# EAGLE schematic Educ-8 (EAGLE 6.6.0)

## Sheet 1 of 3
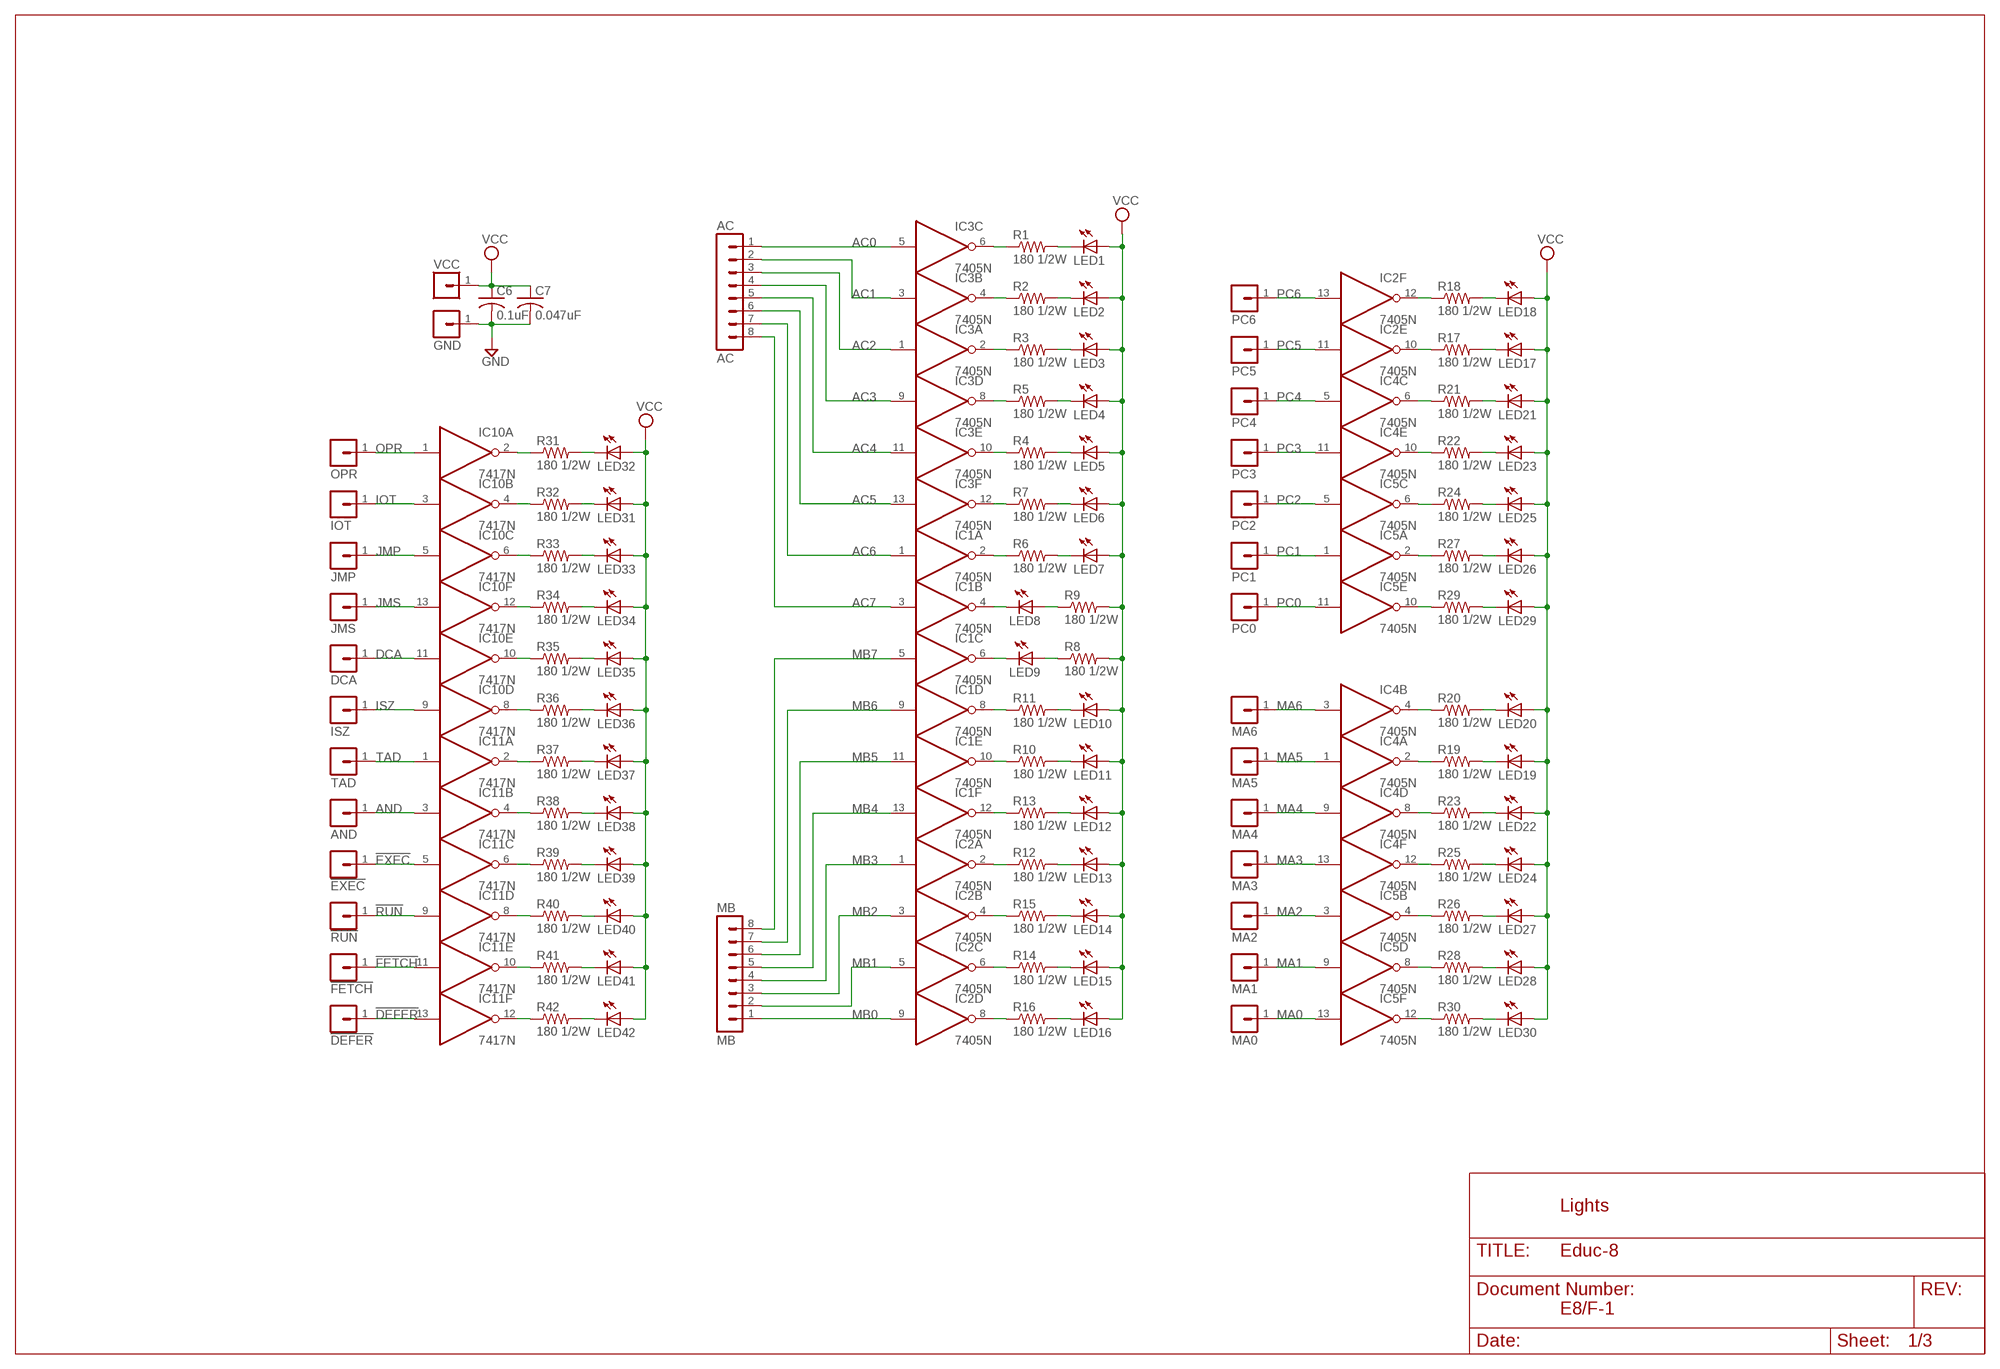
[diagram p0: schematic, sheet 1]

### Parts
!DEFER  MA01-1  [MA01-1]
!EXEC  MA01-1  [MA01-1]
!FETCH  MA01-1  [MA01-1]
!RUN  MA01-1  [MA01-1]
AC  AC  MA08-1  [MA08-1]
AND  MA01-1  [MA01-1]
C6  0.1uF  C-US075-032X103  [C075-032X103]
C7  0.047uF  C-US075-032X103  [C075-032X103]
DCA  MA01-1  [MA01-1]
GND  MA01-1  [MA01-1]
IC1  7405N  [DIL14]
IC2  7405N  [DIL14]
IC3  7405N  [DIL14]
IC4  7405N  [DIL14]
IC5  7405N  [DIL14]
IC10  7417N  [DIL14]
IC11  7417N  [DIL14]
IOT  MA01-1  [MA01-1]
ISZ  MA01-1  [MA01-1]
JMP  MA01-1  [MA01-1]
JMS  MA01-1  [MA01-1]
LED1  LED5MM  [LED5MM]
LED2  LED5MM  [LED5MM]
LED3  LED5MM  [LED5MM]
LED4  LED5MM  [LED5MM]
LED5  LED5MM  [LED5MM]
LED6  LED5MM  [LED5MM]
LED7  LED5MM  [LED5MM]
LED8  LED5MM  [LED5MM]
LED9  LED5MM  [LED5MM]
LED10  LED5MM  [LED5MM]
LED11  LED5MM  [LED5MM]
LED12  LED5MM  [LED5MM]
LED13  LED5MM  [LED5MM]
LED14  LED5MM  [LED5MM]
LED15  LED5MM  [LED5MM]
LED16  LED5MM  [LED5MM]
LED17  LED5MM  [LED5MM]
LED18  LED5MM  [LED5MM]
LED19  LED5MM  [LED5MM]
LED20  LED5MM  [LED5MM]
LED21  LED5MM  [LED5MM]
LED22  LED5MM  [LED5MM]
LED23  LED5MM  [LED5MM]
LED24  LED5MM  [LED5MM]
LED25  LED5MM  [LED5MM]
LED26  LED5MM  [LED5MM]
LED27  LED5MM  [LED5MM]
LED28  LED5MM  [LED5MM]
LED29  LED5MM  [LED5MM]
LED30  LED5MM  [LED5MM]
LED31  LED5MM  [LED5MM]
LED32  LED5MM  [LED5MM]
LED33  LED5MM  [LED5MM]
LED34  LED5MM  [LED5MM]
LED35  LED5MM  [LED5MM]
LED36  LED5MM  [LED5MM]
LED37  LED5MM  [LED5MM]
LED38  LED5MM  [LED5MM]
LED39  LED5MM  [LED5MM]
LED40  LED5MM  [LED5MM]
LED41  LED5MM  [LED5MM]
LED42  LED5MM  [LED5MM]
MA0  MA01-1  [MA01-1]
MA1  MA01-1  [MA01-1]
MA2  MA01-1  [MA01-1]
MA3  MA01-1  [MA01-1]
MA4  MA01-1  [MA01-1]
MA5  MA01-1  [MA01-1]
MA6  MA01-1  [MA01-1]
MB  MB  MA08-1  [MA08-1]
OPR  MA01-1  [MA01-1]
PC0  MA01-1  [MA01-1]
PC1  MA01-1  [MA01-1]
PC2  MA01-1  [MA01-1]
PC3  MA01-1  [MA01-1]
PC4  MA01-1  [MA01-1]
PC5  MA01-1  [MA01-1]
PC6  MA01-1  [MA01-1]
R1  180 1/2W  R-US_0309/.45  [0309/.45]
R2  180 1/2W  R-US_0309/.45  [0309/.45]
R3  180 1/2W  R-US_0309/.45  [0309/.45]
R4  180 1/2W  R-US_0309/12  [0309/12]
R5  180 1/2W  R-US_0309/.45  [0309/.45]
R6  180 1/2W  R-US_0309/12  [0309/12]
R7  180 1/2W  R-US_0309/.45  [0309/.45]
R8  180 1/2W  R-US_0309/12  [0309/12]
R9  180 1/2W  R-US_0309/12  [0309/12]
R10  180 1/2W  R-US_0309/.45  [0309/.45]
R11  180 1/2W  R-US_0309/11  [0309/11]
R12  180 1/2W  R-US_0309/12  [0309/12]
R13  180 1/2W  R-US_0309/.45  [0309/.45]
R14  180 1/2W  R-US_0309/.45  [0309/.45]
R15  180 1/2W  R-US_0309/12  [0309/12]
R16  180 1/2W  R-US_0309/12  [0309/12]
R17  180 1/2W  R-US_0309/12  [0309/12]
R18  180 1/2W  R-US_0309/12  [0309/12]
R19  180 1/2W  R-US_0309/12  [0309/12]
R20  180 1/2W  R-US_0309/15  [0309/15]
R21  180 1/2W  R-US_0309/.45  [0309/.45]
R22  180 1/2W  R-US_0309/10  [0309/10]
R23  180 1/2W  R-US_0309/10  [0309/10]
R24  180 1/2W  R-US_0309/12  [0309/12]
R25  180 1/2W  R-US_0309/10  [0309/10]
R26  180 1/2W  R-US_0309/10  [0309/10]
R27  180 1/2W  R-US_0309/15  [0309/15]
R28  180 1/2W  R-US_0309/.45  [0309/.45]
R29  180 1/2W  R-US_0309/.45  [0309/.45]
R30  180 1/2W  R-US_0309/.45  [0309/.45]
R31  180 1/2W  R-US_0309/8  [0309/8]
R32  180 1/2W  R-US_0309/8  [0309/8]
R33  180 1/2W  R-US_0309/8  [0309/8]
R34  180 1/2W  R-US_0309/8  [0309/8]
R35  180 1/2W  R-US_0309/8  [0309/8]
R36  180 1/2W  R-US_0309/8  [0309/8]
R37  180 1/2W  R-US_0309/8  [0309/8]
R38  180 1/2W  R-US_0309/8  [0309/8]
R39  180 1/2W  R-US_0309/10  [0309/10]
R40  180 1/2W  R-US_0309/10  [0309/10]
R41  180 1/2W  R-US_0309/10  [0309/10]
R42  180 1/2W  R-US_0309/10  [0309/10]
TAD  MA01-1  [MA01-1]
VCC  MA01-1  [MA01-1]

### Nets
!DEFER: !DEFER.1 IC11.13(F:I)
!EXEC: !EXEC.1 IC11.5(C:I)
!FETCH: !FETCH.1 IC11.11(E:I)
!RUN: !RUN.1 IC11.9(D:I)
AC0: AC.1 IC3.5(C:I)
AC1: AC.2 IC3.3(B:I)
AC2: AC.3 IC3.1(A:I)
AC3: AC.4 IC3.9(D:I)
AC4: AC.5 IC3.11(E:I)
AC5: AC.6 IC3.13(F:I)
AC6: AC.7 IC1.1(A:I)
AC7: AC.8 IC1.3(B:I)
AND: AND.1 IC11.3(B:I)
DCA: DCA.1 IC10.11(E:I)
GND: C6.2 C7.2 GND.1 ; also sheet 2
IOT: IC10.3(B:I) IOT.1
ISZ: IC10.9(D:I) ISZ.1
JMP: IC10.5(C:I) JMP.1
JMS: IC10.13(F:I) JMS.1
MA0: IC5.13(F:I) MA0.1
MA1: IC5.9(D:I) MA1.1
MA2: IC5.3(B:I) MA2.1
MA3: IC4.13(F:I) MA3.1
MA4: IC4.9(D:I) MA4.1
MA5: IC4.1(A:I) MA5.1
MA6: IC4.3(B:I) MA6.1
MB0: IC2.9(D:I) MB.1
MB1: IC2.5(C:I) MB.2
MB2: IC2.3(B:I) MB.3
MB3: IC2.1(A:I) MB.4
MB4: IC1.13(F:I) MB.5
MB5: IC1.11(E:I) MB.6
MB6: IC1.9(D:I) MB.7
MB7: IC1.5(C:I) MB.8
N$1: IC2.12(F:O) R18.1
N$2: IC2.10(E:O) R17.1
N$3: IC3.6(C:O) R1.1
N$4: IC3.4(B:O) R2.1
N$5: IC3.2(A:O) R3.1
N$6: IC3.12(F:O) R7.1
N$7: LED7.K(C) R6.2
N$8: LED12.K(C) R13.2
N$9: IC1.10(E:O) R10.1
N$10: LED10.K(C) R11.2
N$11: IC1.6(C:O) LED9.K(C)
N$12: LED8.A R9.1
N$13: IC1.2(A:O) R6.1
N$14: LED9.A R8.1
N$15: IC1.4(B:O) LED8.K(C)
N$16: IC1.8(D:O) R11.1
N$17: LED11.K(C) R10.2
N$18: IC2.8(D:O) R16.1
N$19: LED13.K(C) R12.2
N$20: LED18.K(C) R18.2
N$21: LED17.K(C) R17.2
N$22: LED16.K(C) R16.2
N$23: LED15.K(C) R14.2
N$24: LED14.K(C) R15.2
N$25: IC2.6(C:O) R14.1
N$26: IC2.4(B:O) R15.1
N$27: IC2.2(A:O) R12.1
N$28: IC1.12(F:O) R13.1
N$29: IC3.10(E:O) R4.1
N$30: IC3.8(D:O) R5.1
N$31: LED1.K(C) R1.2
N$32: LED6.K(C) R7.2
N$33: LED5.K(C) R4.2
N$34: LED4.K(C) R5.2
N$35: LED3.K(C) R3.2
N$36: LED2.K(C) R2.2
N$37: LED25.K(C) R24.2
N$38: LED19.K(C) R19.2
N$39: LED24.K(C) R25.2
N$40: LED23.K(C) R22.2
N$41: LED22.K(C) R23.2
N$42: LED21.K(C) R21.2
N$43: IC5.6(C:O) R24.1
N$44: LED26.K(C) R27.2
N$45: LED27.K(C) R26.2
N$46: LED28.K(C) R28.2
N$47: LED29.K(C) R29.2
N$48: LED30.K(C) R30.2
N$49: LED31.K(C) R32.2
N$50: LED32.K(C) R31.2
N$51: LED33.K(C) R33.2
N$52: LED34.K(C) R34.2
N$53: LED35.K(C) R35.2
N$54: LED36.K(C) R36.2
N$55: IC5.2(A:O) R27.1
N$56: IC5.12(F:O) R30.1
N$57: IC5.10(E:O) R29.1
N$58: IC5.8(D:O) R28.1
N$59: LED37.K(C) R37.2
N$60: IC5.4(B:O) R26.1
N$109: LED40.K(C) R40.2
N$110: LED39.K(C) R39.2
N$111: LED38.K(C) R38.2
N$112: LED42.K(C) R42.2
N$113: LED41.K(C) R41.2
N$115: IC10.2(A:O) R31.1
N$116: IC10.8(D:O) R36.1
N$117: IC10.10(E:O) R35.1
N$118: IC10.12(F:O) R34.1
N$119: IC10.6(C:O) R33.1
N$120: IC10.4(B:O) R32.1
N$127: IC11.2(A:O) R37.1
N$128: IC11.12(F:O) R42.1
N$129: IC11.10(E:O) R41.1
N$130: IC11.8(D:O) R40.1
N$131: IC11.6(C:O) R39.1
N$132: IC11.4(B:O) R38.1
N$134: LED20.K(C) R20.2
N$135: IC4.2(A:O) R19.1
N$136: IC4.4(B:O) R20.1
N$137: IC4.6(C:O) R21.1
N$138: IC4.12(F:O) R25.1
N$140: IC4.10(E:O) R22.1
N$141: IC4.8(D:O) R23.1
OPR: IC10.1(A:I) OPR.1
PC0: IC5.11(E:I) PC0.1
PC1: IC5.1(A:I) PC1.1
PC2: IC5.5(C:I) PC2.1
PC3: IC4.11(E:I) PC3.1
PC4: IC4.5(C:I) PC4.1
PC5: IC2.11(E:I) PC5.1
PC6: IC2.13(F:I) PC6.1
TAD: IC11.1(A:I) TAD.1
VCC: C6.1 C7.1 LED1.A LED2.A LED3.A LED4.A LED5.A LED6.A LED7.A LED10.A LED11.A LED12.A LED13.A LED14.A LED15.A LED16.A LED17.A LED18.A LED19.A LED20.A LED21.A LED22.A LED23.A LED24.A LED25.A LED26.A LED27.A LED28.A LED29.A LED30.A LED31.A LED32.A LED33.A LED34.A LED35.A LED36.A LED37.A LED38.A LED39.A LED40.A LED41.A LED42.A R8.2 R9.2 VCC.1 ; also sheet 2

### Notes on the sheet
- Lights
- E8/F-1

## Sheet 2 of 3
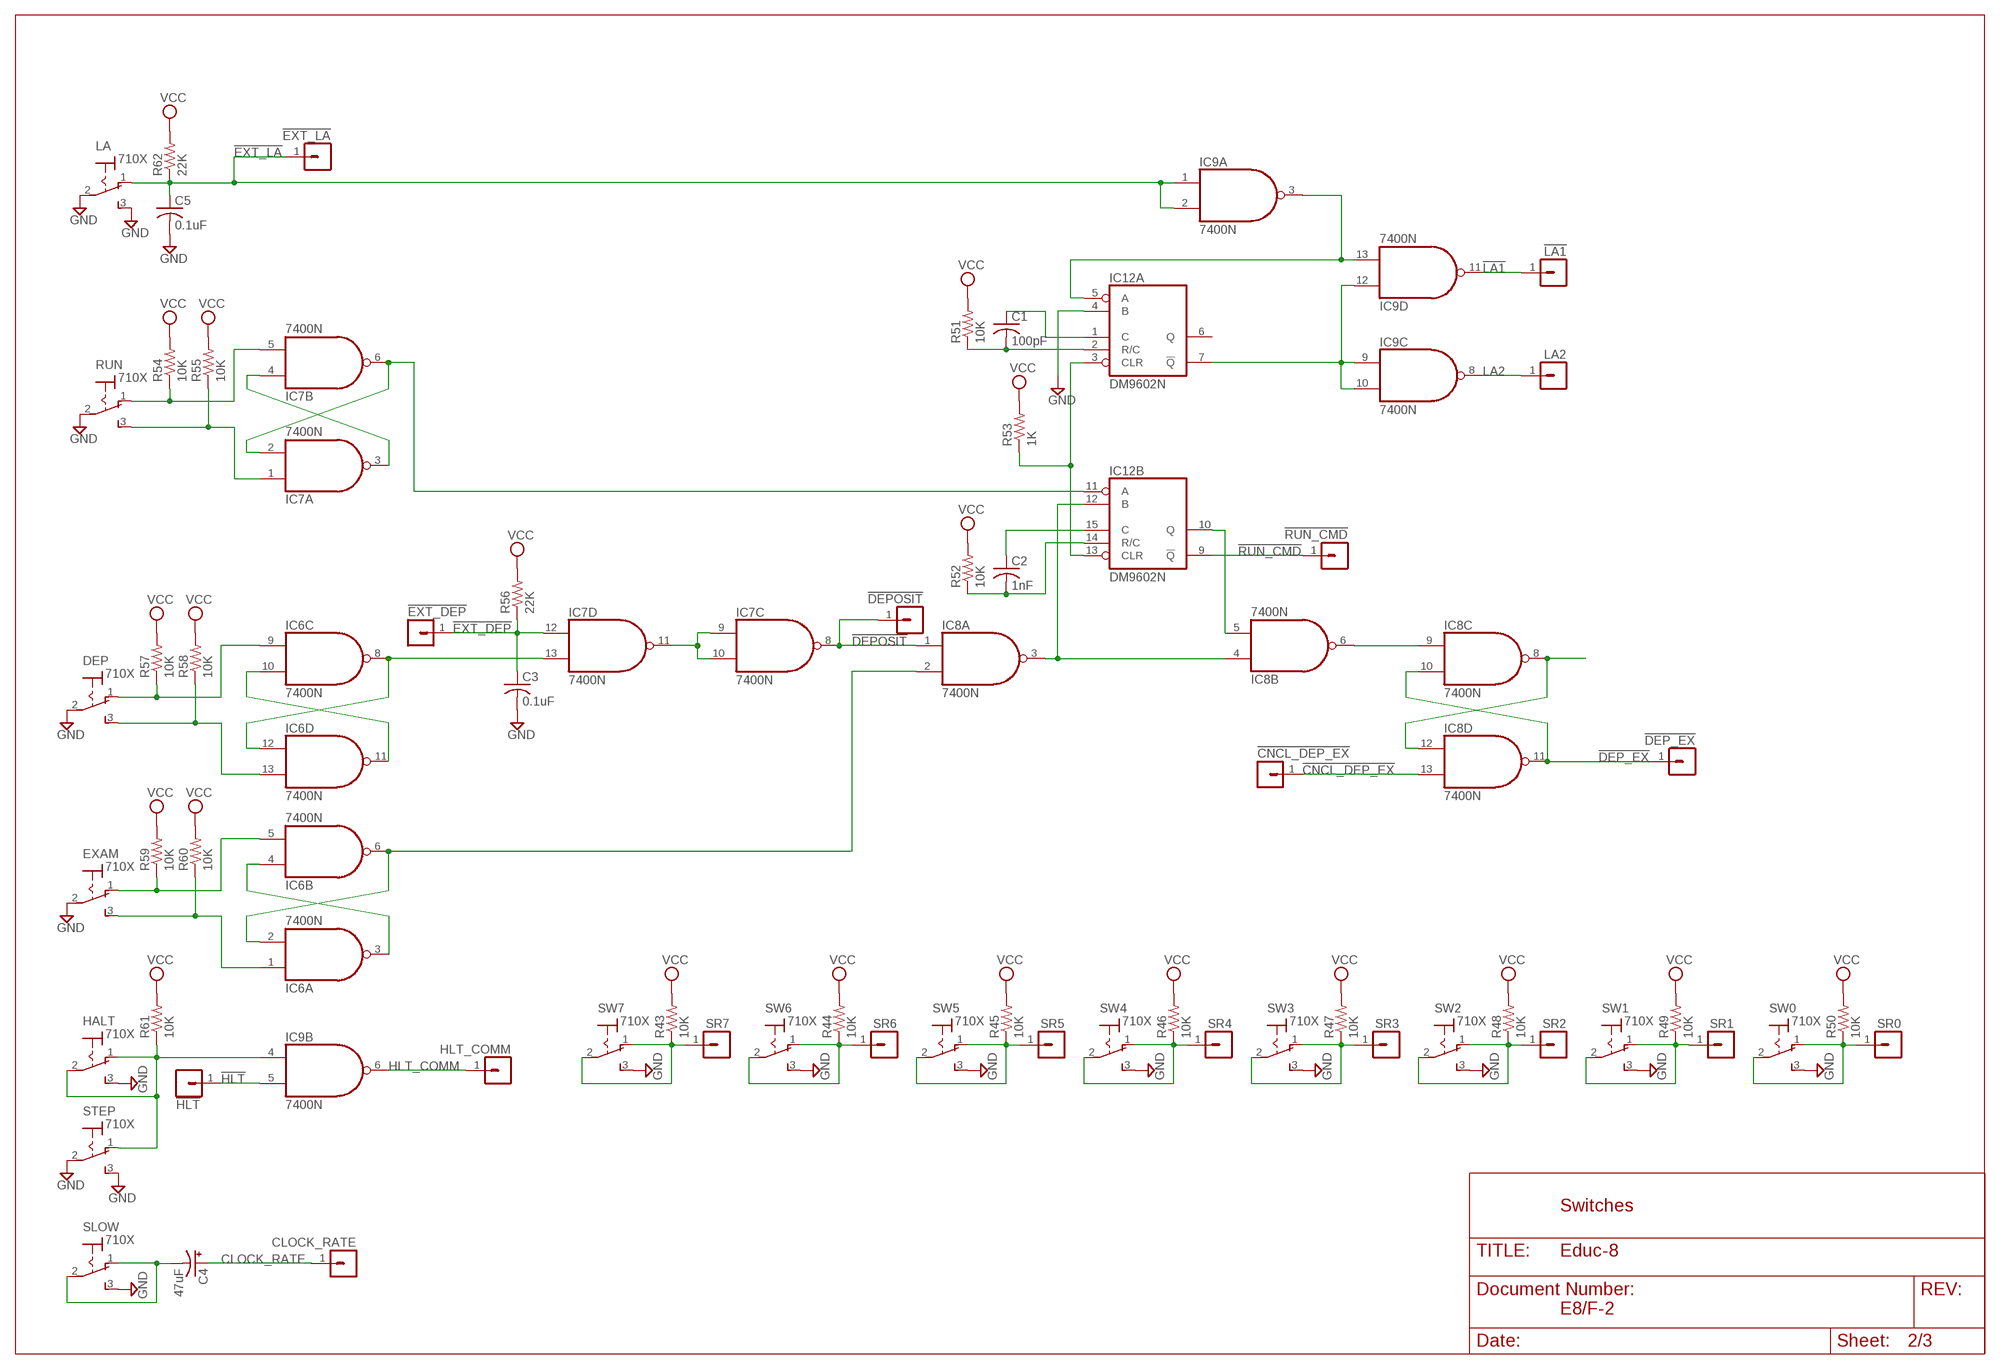
[diagram p1: schematic, sheet 2]

### Parts
!CNCL_DEP_EX  MA01-1  [MA01-1]
!DEP_EX  MA01-1  [MA01-1]
!DEPOSIT  MA01-1  [MA01-1]
!EXT_DEP  MA01-1  [MA01-1]
!EXT_LA  MA01-1  [MA01-1]
!HLT  MA01-1  [MA01-1]
!LA1  MA01-1  [MA01-1]
!RUN_CMD  MA01-1  [MA01-1]
C1  100pF  C-US075-032X103  [C075-032X103]
C2  1nF  C-US075-032X103  [C075-032X103]
C3  0.1uF  C-US  [C063-025X075]
C4  47uF  CPOL-USB45181C  [B45181C]
C5  0.1uF  C-US075-032X103  [C075-032X103]
CLOCK_RATE  MA01-1  [MA01-1]
DEP  710X  [7109]
EXAM  710X  [7109]
HALT  710X  [7109]
HLT_COMM  MA01-1  [MA01-1]
IC6  7400N  [DIL14]
IC7  7400N  [DIL14]
IC8  7400N  [DIL14]
IC9  7400N  [DIL14]
IC12  DM9602N  [DIL16]
LA  710X  [7109]
LA2  MA01-1  [MA01-1]
R43  10K  R-US_0207/12  [0207/12]
R44  10K  R-US_0207/12  [0207/12]
R45  10K  R-US_0207/12  [0207/12]
R46  10K  R-US_0207/12  [0207/12]
R47  10K  R-US_0207/12  [0207/12]
R48  10K  R-US_0207/12  [0207/12]
R49  10K  R-US_0207/12  [0207/12]
R50  10K  R-US_0207/12  [0207/12]
R51  10K  R-US_0207/10  [0207/10]
R52  10K  R-US_0207/15  [0207/15]
R53  1K  R-US_0204/6  [0204/6]
R54  10K  R-US_0207/13  [0207/13]
R55  10K  R-US_0207/13  [0207/13]
R56  22K  R-US_0207/10  [0207/10]
R57  10K  R-US_0207/13  [0207/13]
R58  10K  R-US_0207/13  [0207/13]
R59  10K  R-US_0207/13  [0207/13]
R60  10K  R-US_0207/13  [0207/13]
R61  10K  R-US_0207/22  [0207/22]
R62  22K  R-US_0207/13  [0207/13]
RUN  710X  [7109]
SLOW  710X  [7109]
SR0  MA01-1  [MA01-1]
SR1  MA01-1  [MA01-1]
SR2  MA01-1  [MA01-1]
SR3  MA01-1  [MA01-1]
SR4  MA01-1  [MA01-1]
SR5  MA01-1  [MA01-1]
SR6  MA01-1  [MA01-1]
SR7  MA01-1  [MA01-1]
STEP  710X  [7109]
SW0  710X  [7109]
SW1  710X  [7109]
SW2  710X  [7109]
SW3  710X  [7109]
SW4  710X  [7109]
SW5  710X  [7109]
SW6  710X  [7109]
SW7  710X  [7109]

### Nets
!CNCL_DEP_EX: !CNCL_DEP_EX.1 IC8.13(D:I1)
!DEP_EX: !DEP_EX.1 IC8.10(C:I1) IC8.11(D:O)
!DEPOSIT: !DEPOSIT.1 IC7.8(C:O) IC8.1(A:I0)
!EXT_DEP: !EXT_DEP.1 C3.1 IC7.12(D:I0) R56.1
!EXT_LA: !EXT_LA.1 C5.1 IC9.1(A:I0) IC9.2(A:I1) LA.1(O) R62.1
!HLT: !HLT.1 IC9.5(B:I1)
!LA1: !LA1.1 IC9.11(D:O)
!RUN_CMD: !RUN_CMD.1 IC12.9(B:!Q)
CLOCK_RATE: C4.+ CLOCK_RATE.1
GND: C3.2 C5.2 DEP.2(P) EXAM.2(P) HALT.3(S) IC12.4(A:B) LA.2(P) LA.3(S) RUN.2(P) SLOW.3(S) STEP.2(P) STEP.3(S) SW0.3(S) SW1.3(S) SW2.3(S) SW3.3(S) SW4.3(S) SW5.3(S) SW6.3(S) SW7.3(S) ; also sheet 1
HALT: HALT.1(O) HALT.2(P) IC9.4(B:I0) R61.1 STEP.1(O)
HLT_COMM: HLT_COMM.1 IC9.6(B:O)
LA2: IC9.8(C:O) LA2.1
N$61: DEP.3(S) IC6.13(D:I1) R58.1
N$62: IC6.3(A:O) IC6.4(B:I0)
N$63: EXAM.1(O) IC6.5(B:I1) R59.1
N$64: IC6.2(A:I1) IC6.6(B:O) IC8.2(A:I1)
N$65: EXAM.3(S) IC6.1(A:I0) R60.1
N$66: IC8.6(B:O) IC8.9(C:I0)
N$67: DEP.1(O) IC6.9(C:I0) R57.1
N$68: IC6.10(C:I1) IC6.11(D:O)
N$69: IC6.8(C:O) IC6.12(D:I0) IC7.13(D:I1)
N$75: IC7.1(A:I0) R55.1 RUN.3(S)
N$76: IC7.2(A:I1) IC7.6(B:O) IC12.11(B:A)
N$77: IC7.3(A:O) IC7.4(B:I0)
N$78: IC7.5(B:I1) R54.1 RUN.1(O)
N$79: IC7.9(C:I0) IC7.10(C:I1) IC7.11(D:O)
N$86: IC8.3(A:O) IC8.4(B:I0) IC12.12(B:B)
N$90: IC8.5(B:I1) IC12.10(B:Q)
N$93: IC8.8(C:O) IC8.12(D:I0)
N$97: IC9.3(A:O) IC9.13(D:I1) IC12.5(A:A)
N$98: C2.2 IC12.14(B:R/C) R52.1
N$100: C1.2 IC12.2(A:R/C) R51.1
N$103: IC9.9(C:I0) IC9.10(C:I1) IC9.12(D:I0) IC12.7(A:!Q)
N$104: C1.1 IC12.1(A:C)
N$105: C2.1 IC12.15(B:C)
N$139: IC12.3(A:CLR) IC12.13(B:CLR) R53.1
SLOW: C4.- SLOW.1(O) SLOW.2(P)
SR0: R50.1 SR0.1 SW0.1(O) SW0.2(P)
SR1: R49.1 SR1.1 SW1.1(O) SW1.2(P)
SR2: R48.1 SR2.1 SW2.1(O) SW2.2(P)
SR3: R47.1 SR3.1 SW3.1(O) SW3.2(P)
SR4: R46.1 SR4.1 SW4.1(O) SW4.2(P)
SR5: R45.1 SR5.1 SW5.1(O) SW5.2(P)
SR6: R44.1 SR6.1 SW6.1(O) SW6.2(P)
SR7: R43.1 SR7.1 SW7.1(O) SW7.2(P)
VCC: R43.2 R44.2 R45.2 R46.2 R47.2 R48.2 R49.2 R50.2 R51.2 R52.2 R53.2 R54.2 R55.2 R56.2 R57.2 R58.2 R59.2 R60.2 R61.2 R62.2 ; also sheet 1
Unconnected: IC12.6(A:Q)

### Notes on the sheet
- Switches
- E8/F-2

## Sheet 3 of 3
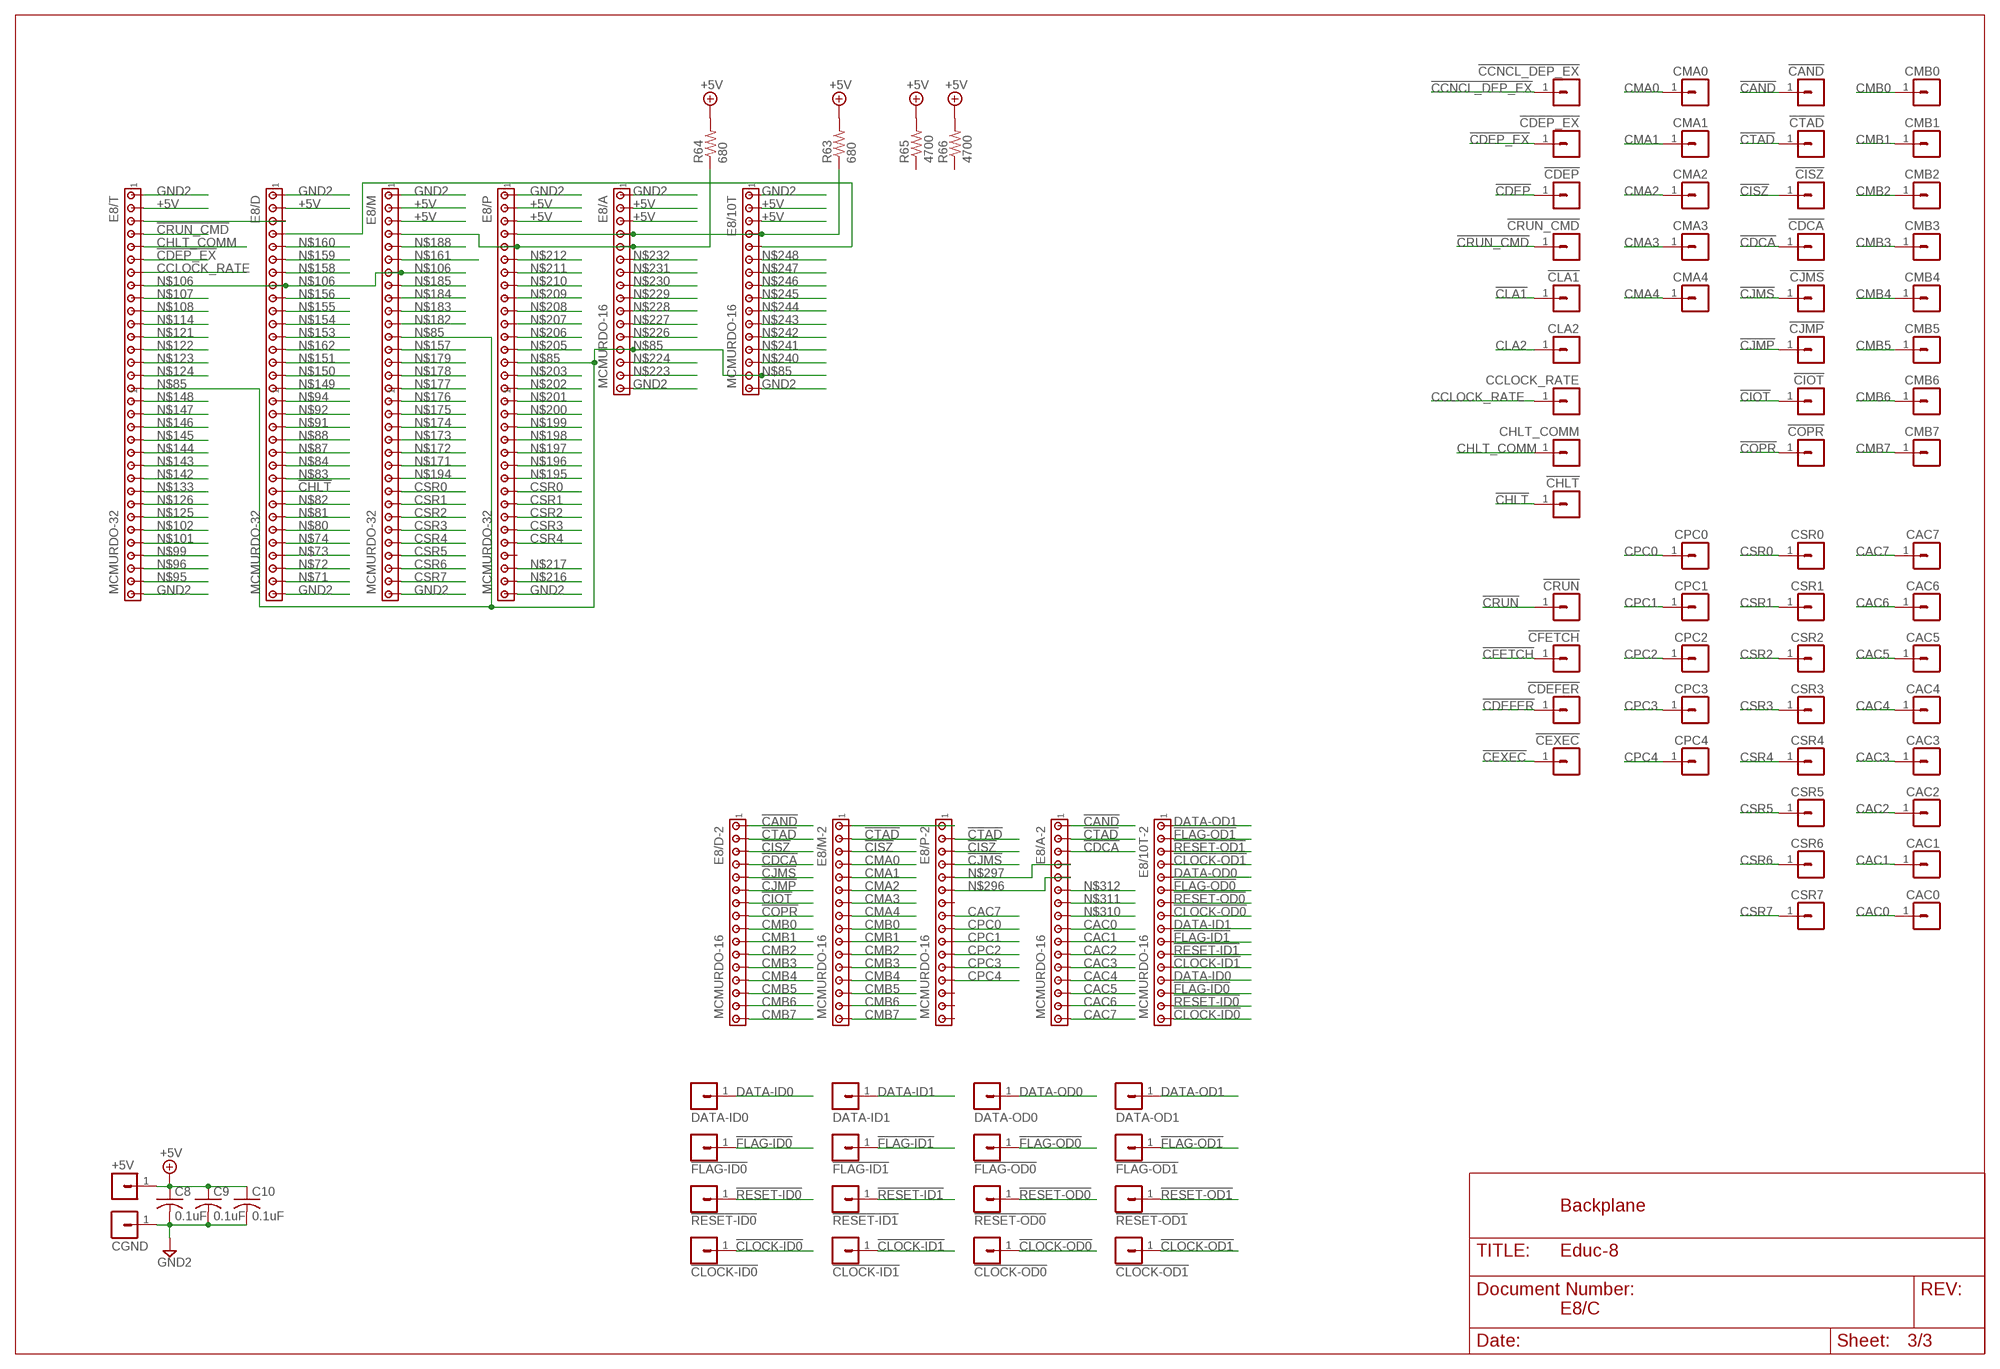
[diagram p2: schematic, sheet 3]

### Parts
!CAND  MA01-1  [MA01-1]
!CCNCL_DEP_EX  MA01-1  [MA01-1]
!CDCA  MA01-1  [MA01-1]
!CDEFER  MA01-1  [MA01-1]
!CDEP  MA01-1  [MA01-1]
!CDEP_EX  MA01-1  [MA01-1]
!CEXEC  MA01-1  [MA01-1]
!CFETCH  MA01-1  [MA01-1]
!CHLT  MA01-1  [MA01-1]
!CIOT  MA01-1  [MA01-1]
!CISZ  MA01-1  [MA01-1]
!CJMP  MA01-1  [MA01-1]
!CJMS  MA01-1  [MA01-1]
!CLA1  MA01-1  [MA01-1]
!CLOCK-ID0  MA01-1  [MA01-1]
!CLOCK-ID1  MA01-1  [MA01-1]
!CLOCK-OD0  MA01-1  [MA01-1]
!CLOCK-OD1  MA01-1  [MA01-1]
!COPR  MA01-1  [MA01-1]
!CRUN  MA01-1  [MA01-1]
!CRUN_CMD  MA01-1  [MA01-1]
!CTAD  MA01-1  [MA01-1]
!FLAG-ID0  MA01-1  [MA01-1]
!FLAG-ID1  MA01-1  [MA01-1]
!FLAG-OD0  MA01-1  [MA01-1]
!FLAG-OD1  MA01-1  [MA01-1]
!RESET-ID0  MA01-1  [MA01-1]
!RESET-ID1  MA01-1  [MA01-1]
!RESET-OD0  MA01-1  [MA01-1]
!RESET-OD1  MA01-1  [MA01-1]
+5V  MA01-1  [MA01-1]
C8  0.1uF  C-US075-032X103  [C075-032X103]
C9  0.1uF  C-US075-032X103  [C075-032X103]
C10  0.1uF  C-US075-032X103  [C075-032X103]
CAC0  MA01-1  [MA01-1]
CAC1  MA01-1  [MA01-1]
CAC2  MA01-1  [MA01-1]
CAC3  MA01-1  [MA01-1]
CAC4  MA01-1  [MA01-1]
CAC5  MA01-1  [MA01-1]
CAC6  MA01-1  [MA01-1]
CAC7  MA01-1  [MA01-1]
CCLOCK_RATE  MA01-1  [MA01-1]
CGND  MA01-1  [MA01-1]
CHLT_COMM  MA01-1  [MA01-1]
CLA2  MA01-1  [MA01-1]
CMA0  MA01-1  [MA01-1]
CMA1  MA01-1  [MA01-1]
CMA2  MA01-1  [MA01-1]
CMA3  MA01-1  [MA01-1]
CMA4  MA01-1  [MA01-1]
CMB0  MA01-1  [MA01-1]
CMB1  MA01-1  [MA01-1]
CMB2  MA01-1  [MA01-1]
CMB3  MA01-1  [MA01-1]
CMB4  MA01-1  [MA01-1]
CMB5  MA01-1  [MA01-1]
CMB6  MA01-1  [MA01-1]
CMB7  MA01-1  [MA01-1]
CPC0  MA01-1  [MA01-1]
CPC1  MA01-1  [MA01-1]
CPC2  MA01-1  [MA01-1]
CPC3  MA01-1  [MA01-1]
CPC4  MA01-1  [MA01-1]
CSR0  MA01-1  [MA01-1]
CSR1  MA01-1  [MA01-1]
CSR2  MA01-1  [MA01-1]
CSR3  MA01-1  [MA01-1]
CSR4  MA01-1  [MA01-1]
CSR5  MA01-1  [MA01-1]
CSR6  MA01-1  [MA01-1]
CSR7  MA01-1  [MA01-1]
DATA-ID0  MA01-1  [MA01-1]
DATA-ID1  MA01-1  [MA01-1]
DATA-OD0  MA01-1  [MA01-1]
DATA-OD1  MA01-1  [MA01-1]
E8/10T  MCMURDO-16  [133-12-17]
E8/10T-2  MCMURDO-16  [133-12-17]
E8/A  MCMURDO-16  [133-12-17]
E8/A-2  MCMURDO-16  [133-12-17]
E8/D  MCMURDO-32  [133-14-17]
E8/D-2  MCMURDO-16  [133-12-17]
E8/M  MCMURDO-32  [133-14-17]
E8/M-2  MCMURDO-16  [133-12-17]
E8/P  MCMURDO-32  [133-14-17]
E8/P-2  MCMURDO-16  [133-12-17]
E8/T  MCMURDO-32  [133-14-17]
R63  680  R-US_0207/15  [0207/15]
R64  680  R-US_0207/15  [0207/15]
R65  4700  R-US_0207/15  [0207/15]
R66  4700  R-US_0207/15  [0207/15]

### Nets
!CAND: !CAND.1 E8/A-2.1 E8/D-2.1
!CCNCL_DEP_EX: !CCNCL_DEP_EX.1
!CDCA: !CDCA.1 E8/A-2.3 E8/D-2.4
!CDEFER: !CDEFER.1
!CDEP: !CDEP.1
!CDEP_EX: !CDEP_EX.1 E8/T.6
!CEXEC: !CEXEC.1
!CFETCH: !CFETCH.1
!CHLT: !CHLT.1 E8/D.24
!CIOT: !CIOT.1 E8/D-2.7
!CISZ: !CISZ.1 E8/D-2.3 E8/M-2.3 E8/P-2.3
!CJMP: !CJMP.1 E8/D-2.6
!CJMS: !CJMS.1 E8/D-2.5 E8/P-2.4
!CLA1: !CLA1.1
!CLOCK-ID0: !CLOCK-ID0.1 E8/10T-2.16
!CLOCK-ID1: !CLOCK-ID1.1 E8/10T-2.12
!CLOCK-OD0: !CLOCK-OD0.1 E8/10T-2.8
!CLOCK-OD1: !CLOCK-OD1.1 E8/10T-2.4
!COPR: !COPR.1 E8/D-2.8
!CRUN: !CRUN.1
!CRUN_CMD: !CRUN_CMD.1 E8/T.4
!CTAD: !CTAD.1 E8/A-2.2 E8/D-2.2 E8/M-2.2 E8/P-2.2
!FLAG-ID0: !FLAG-ID0.1 E8/10T-2.14
!FLAG-ID1: !FLAG-ID1.1 E8/10T-2.10
!FLAG-OD0: !FLAG-OD0.1 E8/10T-2.6
!FLAG-OD1: !FLAG-OD1.1 E8/10T-2.2
!RESET-ID0: !RESET-ID0.1 E8/10T-2.15
!RESET-ID1: !RESET-ID1.1 E8/10T-2.11
!RESET-OD0: !RESET-OD0.1 E8/10T-2.7
!RESET-OD1: !RESET-OD1.1 E8/10T-2.3
+5V: +5V.1 C8.1 C9.1 C10.1 E8/10T.2 E8/10T.3 E8/A.2 E8/A.3 E8/D.2 E8/M.2 E8/M.3 E8/P.2 E8/P.3 E8/T.2 R63.2 R64.2 R65.2 R66.2
CAC0: CAC0.1 E8/A-2.9
CAC1: CAC1.1 E8/A-2.10
CAC2: CAC2.1 E8/A-2.11
CAC3: CAC3.1 E8/A-2.12
CAC4: CAC4.1 E8/A-2.13
CAC5: CAC5.1 E8/A-2.14
CAC6: CAC6.1 E8/A-2.15
CAC7: CAC7.1 E8/A-2.16 E8/P-2.8
CCLOCK_RATE: CCLOCK_RATE.1 E8/T.7
CHLT_COMM: CHLT_COMM.1 E8/T.5
CLA2: CLA2.1
CMA0: CMA0.1 E8/M-2.4
CMA1: CMA1.1 E8/M-2.5
CMA2: CMA2.1 E8/M-2.6
CMA3: CMA3.1 E8/M-2.7
CMA4: CMA4.1 E8/M-2.8
CMB0: CMB0.1 E8/D-2.9 E8/M-2.9
CMB1: CMB1.1 E8/D-2.10 E8/M-2.10
CMB2: CMB2.1 E8/D-2.11 E8/M-2.11
CMB3: CMB3.1 E8/D-2.12 E8/M-2.12
CMB4: CMB4.1 E8/D-2.13 E8/M-2.13
CMB5: CMB5.1 E8/D-2.14 E8/M-2.14
CMB6: CMB6.1 E8/D-2.15 E8/M-2.15
CMB7: CMB7.1 E8/D-2.16 E8/M-2.16
CPC0: CPC0.1 E8/P-2.9
CPC1: CPC1.1 E8/P-2.10
CPC2: CPC2.1 E8/P-2.11
CPC3: CPC3.1 E8/P-2.12
CPC4: CPC4.1 E8/P-2.13
CSR0: CSR0.1 E8/M.24 E8/P.24
CSR1: CSR1.1 E8/M.25 E8/P.25
CSR2: CSR2.1 E8/M.26 E8/P.26
CSR3: CSR3.1 E8/M.27 E8/P.27
CSR4: CSR4.1 E8/M.28 E8/P.28
CSR5: CSR5.1 E8/M.29
CSR6: CSR6.1 E8/M.30
CSR7: CSR7.1 E8/M.31
DATA-ID0: DATA-ID0.1 E8/10T-2.13
DATA-ID1: DATA-ID1.1 E8/10T-2.9
DATA-OD0: DATA-OD0.1 E8/10T-2.5
DATA-OD1: DATA-OD1.1 E8/10T-2.1
GND2: C8.2 C9.2 C10.2 CGND.1 E8/10T.1 E8/10T.16 E8/A.1 E8/A.16 E8/D.1 E8/D.32 E8/M.1 E8/M.32 E8/P.1 E8/P.32 E8/T.1 E8/T.32
N$70: E8/10T.5 E8/D.4
N$71: E8/D.31
N$72: E8/D.30
N$73: E8/D.29
N$74: E8/D.28
N$80: E8/D.27
N$81: E8/D.26
N$82: E8/D.25
N$83: E8/D.23
N$84: E8/D.22
N$85: E8/10T.15 E8/A.13 E8/M.12 E8/P.14 E8/T.16
N$87: E8/D.21
N$88: E8/D.20
N$89: E8/D.3 E8/T.3
N$91: E8/D.19
N$92: E8/D.18
N$94: E8/D.17
N$95: E8/T.31
N$96: E8/T.30
N$99: E8/T.29
N$101: E8/T.28
N$102: E8/T.27
N$106: E8/D.8 E8/M.7 E8/T.8
N$107: E8/T.9
N$108: E8/T.10
N$114: E8/T.11
N$121: E8/T.12
N$122: E8/T.13
N$123: E8/T.14
N$124: E8/T.15
N$125: E8/T.26
N$126: E8/T.25
N$133: E8/T.24
N$142: E8/T.23
N$143: E8/T.22
N$144: E8/T.21
N$145: E8/T.20
N$146: E8/T.19
N$147: E8/T.18
N$148: E8/T.17
N$149: E8/D.16
N$150: E8/D.15
N$151: E8/D.14
N$153: E8/D.12
N$154: E8/D.11
N$155: E8/D.10
N$156: E8/D.9
N$157: E8/M.13
N$158: E8/D.7
N$159: E8/D.6
N$160: E8/D.5
N$161: E8/M.6
N$162: E8/D.13
N$171: E8/M.22
N$172: E8/M.21
N$173: E8/M.20
N$174: E8/M.19
N$175: E8/M.18
N$176: E8/M.17
N$177: E8/M.16
N$178: E8/M.15
N$179: E8/M.14
N$182: E8/M.11
N$183: E8/M.10
N$184: E8/M.9
N$185: E8/M.8
N$187: E8/A.5 E8/M.4 E8/P.5 R64.1
N$188: E8/M.5
N$194: E8/M.23
N$195: E8/P.23
N$196: E8/P.22
N$197: E8/P.21
N$198: E8/P.20
N$199: E8/P.19
N$200: E8/P.18
N$201: E8/P.17
N$202: E8/P.16
N$203: E8/P.15
N$205: E8/P.13
N$206: E8/P.12
N$207: E8/P.11
N$208: E8/P.10
N$209: E8/P.9
N$210: E8/P.8
N$211: E8/P.7
N$212: E8/P.6
N$214: E8/10T.4 E8/A.4 E8/P.4 R63.1
N$216: E8/P.31
N$217: E8/P.30
N$223: E8/A.15
N$224: E8/A.14
N$226: E8/A.12
N$227: E8/A.11
N$228: E8/A.10
N$229: E8/A.9
N$230: E8/A.8
N$231: E8/A.7
N$232: E8/A.6
N$240: E8/10T.14
N$241: E8/10T.13
N$242: E8/10T.12
N$243: E8/10T.11
N$244: E8/10T.10
N$245: E8/10T.9
N$246: E8/10T.8
N$247: E8/10T.7
N$248: E8/10T.6
N$269: E8/M-2.1 E8/P-2.1
N$296: E8/A-2.5 E8/P-2.6
N$297: E8/A-2.4 E8/P-2.5
N$310: E8/A-2.8
N$311: E8/A-2.7
N$312: E8/A-2.6
Unconnected: E8/P-2.7 E8/P-2.14 E8/P-2.15 E8/P-2.16 E8/P.29 R65.1 R66.1

### Notes on the sheet
- Backplane
- E8/C

## Power pins joined to a net without a drawn wire
GND: IC1.7(P:GND) IC2.7(P:GND) IC3.7(P:GND) IC4.7(P:GND) IC5.7(P:GND) IC6.7(P:GND) IC7.7(P:GND) IC8.7(P:GND) IC9.7(P:GND) IC10.7(P:GND) IC11.7(P:GND) IC12.8(P:GND)
VCC: IC1.14(P:VCC) IC2.14(P:VCC) IC3.14(P:VCC) IC4.14(P:VCC) IC5.14(P:VCC) IC6.14(P:VCC) IC7.14(P:VCC) IC8.14(P:VCC) IC9.14(P:VCC) IC10.14(P:VCC) IC11.14(P:VCC) IC12.16(P:VCC)

## Library data of the parts
!CAND !CCNCL_DEP_EX !CDCA !CDEFER !CDEP !CDEP_EX !CEXEC !CFETCH !CHLT !CIOT !CISZ !CJMP !CJMS !CLA1 !CLOCK-ID0 !CLOCK-ID1 !CLOCK-OD0 !CLOCK-OD1 !CNCL_DEP_EX !COPR !CRUN !CRUN_CMD !CTAD !DEFER !DEP_EX !DEPOSIT !EXEC !EXT_DEP !EXT_LA !FETCH !FLAG-ID0 !FLAG-ID1 !FLAG-OD0 !FLAG-OD1 !HLT !LA1 !RESET-ID0 !RESET-ID1 !RESET-OD0 !RESET-OD1 !RUN !RUN_CMD +5V AND CAC0 CAC1-CAC7 CCLOCK_RATE CGND CHLT_COMM CLA2 CLOCK_RATE CMA0 CMA1-CMA4 CMB0 CMB1-CMB7 CPC0 CPC1-CPC4 CSR0 CSR1-CSR7 DATA-ID0 DATA-ID1 DATA-OD0 DATA-OD1 DCA GND HLT_COMM IOT ISZ JMP JMS LA2 MA0 MA1-MA6 OPR PC0 PC1-PC6 SR0 SR1-SR7 TAD VCC = dec-con:MA01-1: Pin Header (.125" spacing)
AC MB = dec-con:MA08-1: Pin Header (.125" spacing)
C1 C2 C5-C10 = rcl:C-US: CAPACITOR, American symbol
C3 = dec-con:C-US: Capacitors with funky DEC lead spacing.
C4 = rcl:CPOL-US: POLARIZED CAPACITOR, American symbol
DEP EXAM HALT LA RUN SLOW STEP SW0 SW1-SW7 = Educ-8:710X: 710x without optional mounting bracket.
E8/10T E8/10T-2 E8/A E8/A-2 E8/D-2 E8/M-2 E8/P-2 = Educ-8:MCMURDO-16: McMurdo connector, 16 pins
E8/D E8/M E8/P E8/T = Educ-8:MCMURDO-32: McMurdo connector, 32 pins
IC1-IC5 = 74xx-us:74*05: Hex INVERTER, open collector
IC6-IC9 = 74xx-us:74*00: Quad 2-input NAND gate
IC10 IC11 = 74xx-us:74*17: Hex INVERTER, open collector, high-voltage
IC12 = Educ-8:DM9602: Retriggerable monostable MULTIVIBRATOR
LED1-LED42 = led:LED: LED OSRAM: - CHIPLED LG R971, LG N971, LY N971, LG Q971, LY Q971, LO R971, LY R971 LH N974, LH R974 LS Q976, LO Q976, LY Q976 LO Q996 - Hyper CHIPLED LW Q18S LB Q993, LB Q99A, LB R99A - SideLED LS A670, LO A670, LY A670, LG A670, LP A670 LB A673, LV A673, LT A673, LW A673 LH A674 LY A675 LS A676, LA A676, LO A676, LY A676, LW A676 LS A679, LY A679, LG A679 - Hyper Micro SIDELED® LS Y876, LA Y876, LO Y876, LY Y876 LT Y87S - SmartLED LW L88C, LW L88S LB L89C, LB L89S, LG L890 LS L89K, LO L89K, LY L89K LS L896, LA L896, LO L896, LY L896 - TOPLED LS T670, LO T670, LY T670, LG T670, LP T670 LSG T670, LSP T670, LSY T670, LOP T670, LYG T670 LG T671, LOG T671, LSG T671 LB T673, LV T673, LT T673, LW T673 LH T674 LS T676, LA T676, LO T676, LY T676, LB T676, LH T676, LSB T676, LW T676 LB T67C, LV T67C, LT T67C, LS T67K, LO T67K, LY T67K, LW E67C LS E67B, LA E67B, LO E67B, LY E67B, LB E67C, LV E67C, LT E67C LW T67C LS T679, LY T679, LG T679 LS T770, LO T770, LY T770, LG T770, LP T770 LB T773, LV T773, LT T773, LW T773 LH T774 LS E675, LA E675, LY E675, LS T675 LS T776, LA T776, LO T776, LY T776, LB T776 LHGB T686 LT T68C, LB T68C - Hyper Mini TOPLED® LB M676 - Mini TOPLED Santana® LG M470 LS M47K, LO M47K, LY M47K Source: http://www.osram.convergy.de LUXEON: - LUMILED® LXK2-PW12-R00, LXK2-PW12-S00, LXK2-PW14-U00, LXK2-PW14-V00 LXK2-PM12-R00, LXK2-PM12-S00, LXK2-PM14-U00 LXK2-PE12-Q00, LXK2-PE12-R00, LXK2-PE12-S00, LXK2-PE14-T00, LXK2-PE14-U00 LXK2-PB12-K00, LXK2-PB12-L00, LXK2-PB12-M00, LXK2-PB14-N00, LXK2-PB14-P00, LXK2-PB14-Q00 LXK2-PR12-L00, LXK2-PR12-M00, LXK2-PR14-Q00, LXK2-PR14-R00 LXK2-PD12-Q00, LXK2-PD12-R00, LXK2-PD12-S00 LXK2-PH12-R00, LXK2-PH12-S00 LXK2-PL12-P00, LXK2-PL12-Q00, LXK2-PL12-R00 Source: www.luxeon.com KINGBRIGHT: KA-3528ASYC Source: www.kingbright.com
R1-R3 R5 R7 R10 R11 R13 R14 R19-R22 R26-R42 R53-R66 = Educ-8:R-US_: RESISTOR, American symbol
R4 R6 R8 R9 R12 R15-R18 R23-R25 R43-R52 = rcl:R-US_: RESISTOR, American symbol